# Altium schematic sheet TF.SchDoc
size A4
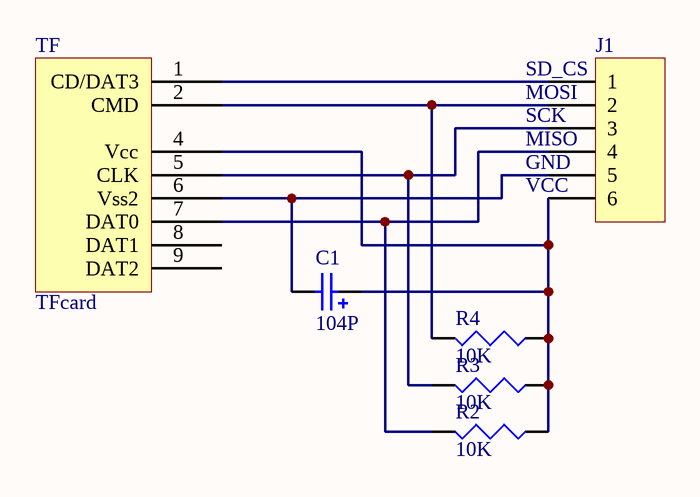
[diagram p0: TF.SchDoc]

## Parts
C1  value 104P  [CC2012-0805]  (hidden comment: Cap Pol3)
J1  Header 6  [HDR1X6]  (value not drawn)
R2  value 10K  [R2012-0805]  (hidden comment: Res3)
R3  value 10K  [R2012-0805]  (hidden comment: Res3)
R4  value 10K  [R2012-0805]  (hidden comment: Res3)
TF  TFcard  [TF Card]

## Nets
NetC1_1: C1.1 J1.6 R2.1 R3.1 R4.1 TF.4(Vcc)
NetC1_2: C1.2 J1.5 TF.6(Vss2)
NetJ1_1: J1.1 TF.1(CD/DAT3)
NetJ1_2: J1.2 R4.2 TF.2(CMD)
NetJ1_3: J1.3 R3.2 TF.5(CLK)
NetJ1_4: J1.4 R2.2 TF.7(DAT0)

Not connected (* = marked no-connect by the designer): TF 8(DAT1) 9(DAT2)

## Notes on the sheet
- (near J1) SD_CS
- (near J1) MOSI
- (near J1) SCK
- (near J1) MISO
- (near J1) GND
- (near J1) VCC

## Library data of the parts
C1 = Cap Pol3: Polarized Capacitor (Surface Mount); Published: 8-Jun-2000; Revision: July-2002: Re-released for DXP Platform.; Publisher: Altium Limited
J1 = Header 6: Header, 6-Pin; Revision: 17-Jul-2002: Re-released for DXP Platform.; Publisher: Altium Limited
R2-R4 = Res3: Resistor; Published: 8-Jun-2000; Revision: July-2002: Re-released for DXP Platform.; Publisher: Altium Limited